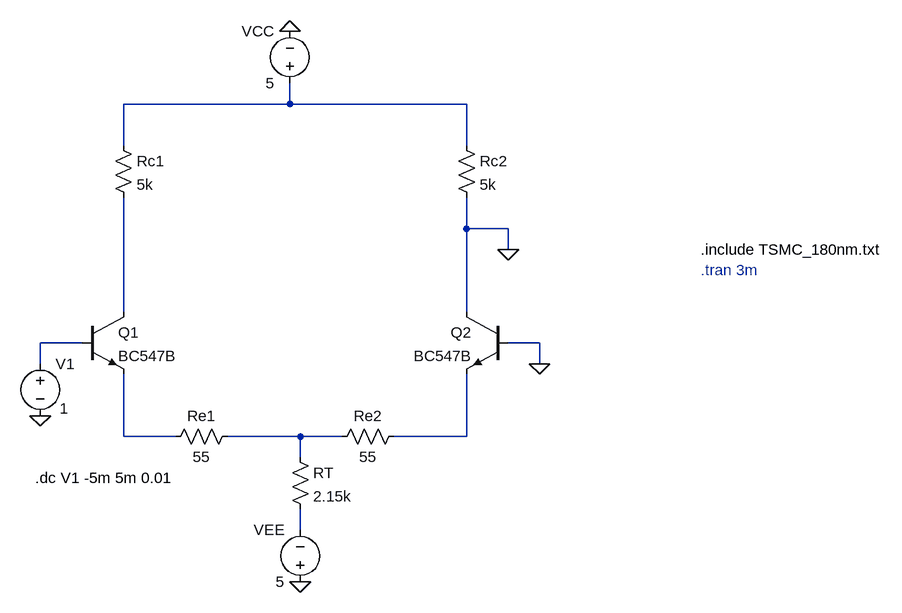
[diagram p0: schematic preamp.asc]
preamp.asc, the LTspice schematic file:
Version 4
SHEET 1 880 680
WIRE -560 -208 -560 -240
WIRE -560 -208 -816 -208
WIRE -288 -208 -560 -208
WIRE -816 -144 -816 -208
WIRE -288 -144 -288 -208
WIRE -288 -16 -288 -64
WIRE -224 -16 -288 -16
WIRE -224 16 -224 -16
WIRE -816 112 -816 -64
WIRE -288 112 -288 -16
WIRE -880 160 -944 160
WIRE -176 160 -224 160
WIRE -944 192 -944 160
WIRE -176 192 -176 160
WIRE -816 304 -816 208
WIRE -736 304 -816 304
WIRE -544 304 -656 304
WIRE -480 304 -544 304
WIRE -288 304 -288 208
WIRE -288 304 -400 304
WIRE -544 336 -544 304
WIRE -544 448 -544 416
FLAG -560 -320 0
FLAG -544 528 0
FLAG -944 272 0
FLAG -176 192 0
FLAG -224 16 0
SYMBOL res -832 -160 R0
SYMATTR InstName Rc1
SYMATTR Value 5k
SYMBOL res -304 -160 R0
SYMATTR InstName Rc2
SYMATTR Value 5k
SYMBOL voltage -560 -224 R180
WINDOW 0 24 96 Left 2
WINDOW 3 24 16 Left 2
WINDOW 123 0 0 Left 0
WINDOW 39 0 0 Left 0
SYMATTR InstName VCC
SYMATTR Value 5
SYMBOL npn -880 112 R0
SYMATTR InstName Q1
SYMATTR Value BC547B
SYMBOL npn -224 112 M0
SYMATTR InstName Q2
SYMATTR Value BC547B
SYMBOL res -560 320 R0
SYMATTR InstName RT
SYMATTR Value 2.15k
SYMBOL voltage -544 544 R180
WINDOW 0 24 96 Left 2
WINDOW 3 24 16 Left 2
WINDOW 123 0 0 Left 0
WINDOW 39 0 0 Left 0
SYMATTR InstName VEE
SYMATTR Value 5
SYMBOL res -640 288 R90
WINDOW 0 0 56 VBottom 2
WINDOW 3 32 56 VTop 2
SYMATTR InstName Re1
SYMATTR Value 55
SYMBOL res -384 288 R90
WINDOW 0 0 56 VBottom 2
WINDOW 3 32 56 VTop 2
SYMATTR InstName Re2
SYMATTR Value 55
SYMBOL voltage -944 176 R0
WINDOW 123 0 0 Left 0
WINDOW 39 0 0 Left 0
WINDOW 3 30 85 Left 2
SYMATTR InstName V1
SYMATTR Value 1
TEXT 72 16 Left 2 !.include TSMC_180nm.txt
TEXT 72 48 Left 2 ;.tran 3m
TEXT -952 368 Left 2 !.dc V1 -5m 5m 0.01

The netlist it stands for:
* preamp.asc
Rc1 N001 N002 5k
Rc2 N001 0 5k
VCC N001 0 5
Q1 N002 N003 N004 0 BC547B
Q2 0 0 N006 0 BC547B
RT N005 N007 2.15k
VEE 0 N007 5
Re1 N005 N004 55
Re2 N006 N005 55
V1 N003 0 1
.model NPN NPN
.model PNP PNP
.lib standard.bjt
.include TSMC_180nm.txt
* .tran 3m
.dc V1 -5m 5m 0.01
.backanno
.end